# Altium project PCB_TeknoFest.PrjPcb
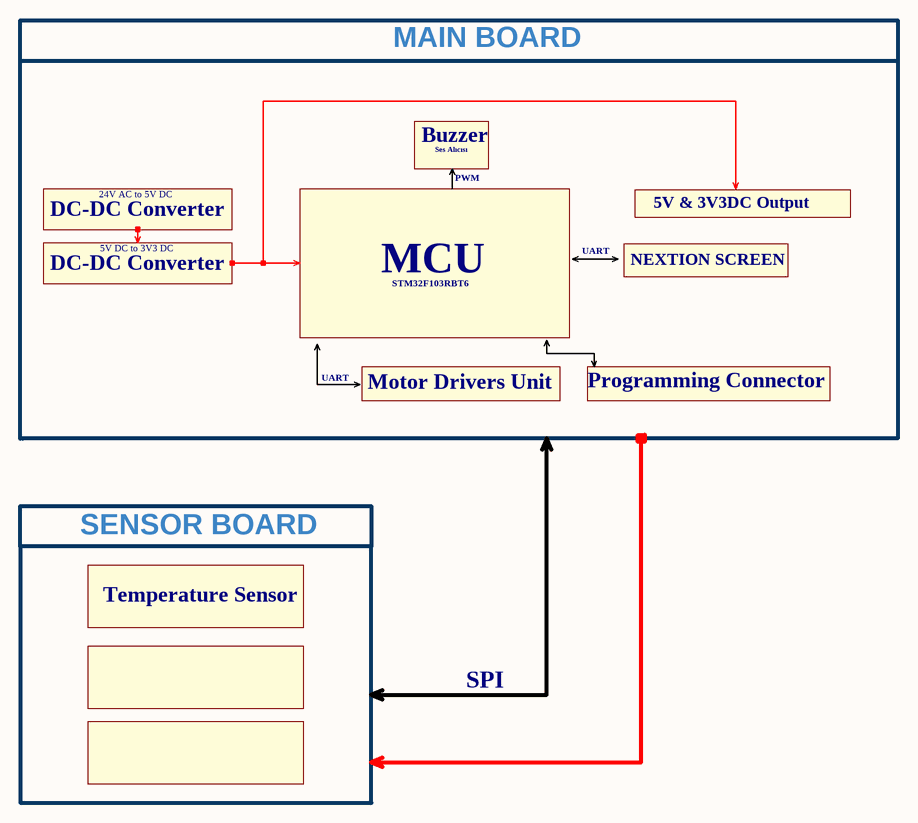
[diagram p0: BlockDiagram.SchDoc]
4 sheets, 71 parts. Net scope: flat (ports and power ports of the same name join across sheets).
Board file: TeknoFest.PcbDoc
Sheets:
  BlockDiagram.SchDoc
  MicroController.SchDoc
  PowerManagement.SchDoc
  MotorDriversUnit.SchDoc

## Sheet BlockDiagram.SchDoc
size A4; SheetNumber: 1; SheetTotal: 4

### Notes on the sheet
- MAIN BOARD
- 24V AC to 5V DC
- Buzzer
- Ses Alıcısı
- PWM
- DC-DC Converter
- 5V DC to 3V3 DC
- UART
- NEXTION SCREEN
- 5V & 3V3DC Output
- MCU
- STM32F103RBT6
- Motor Drivers Unit
- Programming Connector
- SENSOR BOARD
- Temperature Sensor
- SPI

## Sheet MicroController.SchDoc: Teknofest Project
size 381 x 241 mm; Date: 21/12/2023; SheetNumber: 2; SheetTotal: 4; Prepared by: Mustafa Oğuz Ateş
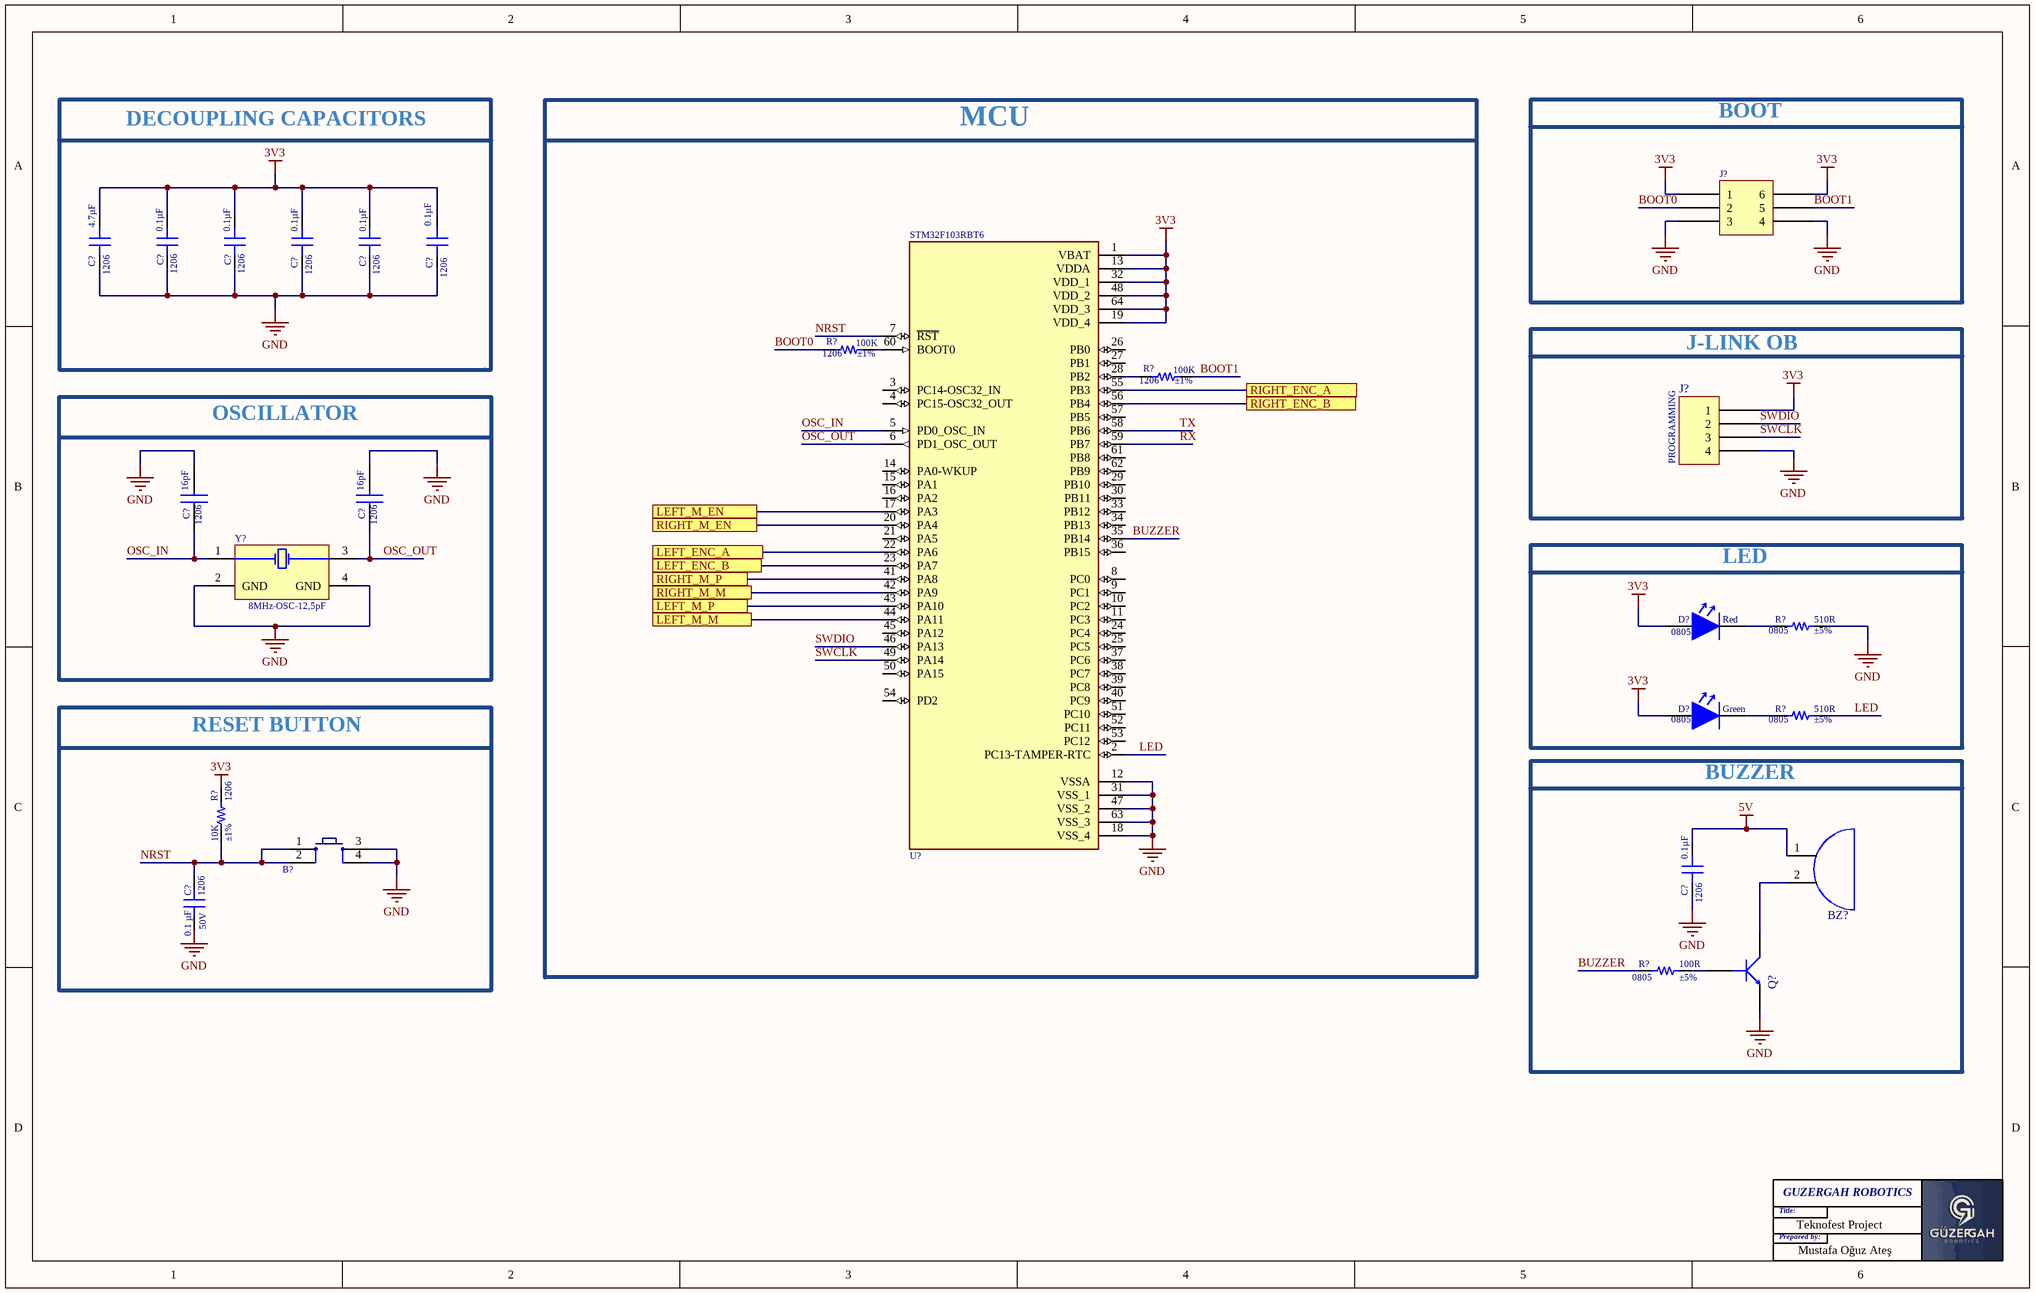
[diagram p1: MicroController.SchDoc]

### Parts
(Parts that share a designator on the sheet are numbered #1, #2 ... from top to bottom, then left to right.)
B?  Push Button  [PUSB BUTTON-SMD]  (value not drawn)
BZ?  CMI-9605IC-0580T  [CMI-9605IC]  (value not drawn)
C?#1  Package / Case: 1206  [CAP 1206_3216 - 1.0MM]  (hidden comment: 4.7µF)
C?#2  Package / Case: 1206  [CAP 1206_3216 - 1.0MM]  (hidden comment: 0.1µF)
C?#3  Package / Case: 1206  [CAP 1206_3216 - 1.0MM]  (hidden comment: 0.1µF)
C?#4  Package / Case: 1206  [CAP 1206_3216 - 1.0MM]  (hidden comment: 0.1µF)
C?#5  Package / Case: 1206  [CAP 1206_3216 - 1.0MM]  (hidden comment: 0.1µF)
C?#6  Package / Case: 1206  [CAP 1206_3216 - 1.0MM]  (hidden comment: 0.1µF)
C?#7  Parameter 1: 16pF  Device Package: 1206  [CAP_1206]
C?#8  Parameter 1: 16pF  Device Package: 1206  [CAP_1206]
C?#9  Package / Case: 1206  [CAP 1206_3216 - 1.0MM]  (hidden comment: 0.1µF)
C?#10  Package / Case: 1206  Voltage - Rated: 50V  [CAP 1206_3216 - 0.8MM]  (hidden comment: 0.1 µF)
D?#1  Color: Red  Case Code (Imperial): 0805  [LED_RED_0805]  (hidden comment: LH R974-LP-1)
D?#2  Case/Package: 0805  Color: Green  [LED_GREEN_0805]  (hidden comment: LTST-C171GKT)
J?#1  M20-7830342  [HARWIN M20-7830345]  (value not drawn)
J?#2  M20-7820442  [HARWIN M20-7820445]  (value not drawn)
Q?  MMBT3904-7-F  [SOT-23F]  (value not drawn)
R?#1  100K  Supplier Device Package: 1206  Tolerance: ±1%  [RES 1206_3216]
R?#2  100K  Supplier Device Package: 1206  Tolerance: ±1%  [RES 1206_3216]
R?#3  Supplier Device Package: 0805  Tolerance: ±5%  [RES 0805_2012]  (hidden comment: 510R)
R?#4  Supplier Device Package: 0805  Tolerance: ±5%  [RES 0805_2012]  (hidden comment: 510R)
R?#5  10K  Supplier Device Package: 1206  Tolerance: ±1%  [RES 1206_3216]
R?#6  Package / Case: 0805  Tolerance: ±5%  [RES 0805_2012]  (hidden comment: 100R)
U?#1  STM32F103RBT6  [LQFP-64]
Y?  8MHz-OSC-12,5pF  [8MHz-OSC]

### Blocks framed on the sheet
DECOUPLING CAPACITORS: C?#1-C?#6
BOOT: J?#1
MCU: R?#1 R?#2 U?#1
J-LINK OB: J?#2
LED: D?#1 D?#2 R?#3 R?#4
BUZZER: BZ? C?#9 Q? R?#6

### Ports
LEFT_ENC_A, LEFT_ENC_B, LEFT_M_EN, LEFT_M_M, LEFT_M_P, RIGHT_ENC_A, RIGHT_ENC_B, RIGHT_M_EN, RIGHT_M_M, RIGHT_M_P

### Nets
3V3: C?#1.2 C?#2.2 C?#3.2 C?#4.2 C?#5.2 C?#6.2 D?#1.2 D?#2.2 J?#1.1 J?#1.6 J?#2.1 R?#5.2 U?#1.1(VBAT) U?#1.13(VDDA) U?#1.19(VDD_4) U?#1.32(VDD_1) U?#1.48(VDD_2) U?#1.64(VDD_3)
5V: BZ?.1 C?#9.2
GND: B?.3 B?.4 C?#1.1 C?#2.1 C?#3.1 C?#4.1 C?#5.1 C?#6.1 C?#7.2 C?#8.2 C?#9.1 C?#10.2 J?#1.3 J?#1.4 J?#2.4 Q?.2(E) R?#3.2 U?#1.12(VSSA) U?#1.18(VSS_4) U?#1.31(VSS_1) U?#1.47(VSS_2) U?#1.63(VSS_3) Y?.2(GND) Y?.4(GND)
BOOT0: J?#1.2 R?#1.2
BOOT1: J?#1.5 R?#2.1
BUZZER: R?#6.1 U?#1.35(PB14)
LED: R?#4.2 U?#1.2(PC13-TAMPER-RTC)
NRST: B?.1 B?.2 C?#10.1 R?#5.1 U?#1.7(~{RST})
OSC_IN: C?#7.1 U?#1.5(PD0_OSC_IN) Y?.1(Tristate)
OSC_OUT: C?#8.1 U?#1.6(PD1_OSC_OUT) Y?.3(OUT)
RX: U?#1.59(PB7)
SWCLK: J?#2.3 U?#1.49(PA14)
SWDIO: J?#2.2 U?#1.46(PA13)
TX: U?#1.58(PB6)
NetBZ?_2: BZ?.2 Q?.3(C)
NetD?#1_1: D?#1.1 R?#3.1
NetD?#2_1: D?#2.1 R?#4.1
NetJ?#10_1: U?#1.17(PA3) ; port LEFT_M_EN
NetJ?#10_2: U?#1.43(PA10) ; port LEFT_M_P
NetJ?#10_3: U?#1.44(PA11) ; port LEFT_M_M
NetJ?#11_1: U?#1.20(PA4) ; port RIGHT_M_EN
NetJ?#11_2: U?#1.41(PA8) ; port RIGHT_M_P
NetJ?#11_3: U?#1.42(PA9) ; port RIGHT_M_M
NetJ?#12_2: U?#1.55(PB3) ; port RIGHT_ENC_A
NetJ?#12_3: U?#1.56(PB4) ; port RIGHT_ENC_B
NetJ?#13_2: U?#1.22(PA6) ; port LEFT_ENC_A
NetJ?#13_3: U?#1.23(PA7) ; port LEFT_ENC_B
NetQ?_1: Q?.1(B) R?#6.2
NetR?#1_1: R?#1.1 U?#1.60(BOOT0)
NetR?#2_2: R?#2.2 U?#1.28(PB2)

Not connected (* = marked no-connect by the designer): U?#1 3(PC14-OSC32_IN) 4(PC15-OSC32_OUT) 8(PC0) 9(PC1) 10(PC2) 11(PC3) 14(PA0-WKUP) 15(PA1) 16(PA2) 21(PA5) 24(PC4) 25(PC5) 26(PB0) 27(PB1) 29(PB10) 30(PB11) 33(PB12) 34(PB13) 36(PB15) 37(PC6) 38(PC7) 39(PC8) 40(PC9) 45(PA12) 50(PA15) 51(PC10) 52(PC11) 53(PC12) 54(PD2) 57(PB5) 61(PB8) 62(PB9)

### Notes on the sheet
- OSCILLATOR
- (near J?#2) PROGRAMMING
- RESET BUTTON
- Title:
- Prepared by:
- GUZERGAH ROBOTICS

### Library data of the parts
B? = Push Button: Smd Push Button; Satın Alma Linki: https://urun.n11.com/diger/mini-pushbutton-switch-smd-P227461537?gclid=Cj0KCQjwkoDmBRCcARIsAG3xzl8Y_-jeD7HocNM6lvuZ_rVp83568XPGtNzlPwXWLph8oCRqo0yh87UaApZYEALw_wcB&gclsrc=aw.ds
BZ? = CMI-9605IC-0580T: Audio Buzzer Magnetic 3VDC 7VDC 30mA 5VDC 85dB 2600Hz to 2800Hz Through Hole Pin Box; Manufacturer: CUI Devices; Designed by: Mustafa; Supplier: Digi-Key; Supplier Part Number: 2223-CMI-9605IC-0580T-ND; Manufacturer Part Number: CMI-9605IC-0580T; RoHS: No; Category: Audio Products; Stock: 5910; Pricing: 1=1,22, 10=1,014, 25=0,938, 50=0,883, 100=0,8298, 250=0,76976, 500=0,71396, 1000=0,66741, 5000=0,65403 (USD); Case/Package: CMI-9605IC
C?#1 = 1206ZC475MAT2A: CAP CER 4.7UF 10V X7R 1206; manufacturer: AVX Corporation; Tolerance: ±20%; Part Number: 1206ZC475MAT2A; Value: 4.7µF; Applications: General Purpose; Capacitance: 4.7µF; componentlink1description: Datasheet; componentlink1url: http://datasheets.avx.com/X7RDielectric.pdf; componentlink2description: DigiKey Link; componentlink2url: http://digikey.com/product-detail/en/avx-corporation/1206ZC475MAT2A/478-12250-1-ND/9565657; Device Package: 1206 (3216 Metric); lastupdated: 2.09.2020 01:05:04; Lifecycle Status: Active; Minimum Order: 1; Mounting Type: Surface Mount, MLCC; Operating Temperature: -55°C ~ 125°C; packaging: TapeAndReel; partid: 19450; Part Status: Active; price: 0.08; series: -; Size / Dimension: 0.126" L x 0.063" W (3.20mm x 1.60mm); Supplier 1: DigiKey; Supplier Part Number 1: 478-12250-1-ND; Temperature Coefficient: X7R; Thickness (Max): 0.037" (0.94mm); Voltage - Rated: 10V
C?#2-C?#6 C?#9 = 1206ZC475MAT2A: CAP CER 4.7UF 10V X7R 1206; manufacturer: AVX Corporation; Capacitance: 40.1µF; Tolerance: ±20%; Part Number: 1206ZC475MAT2A; Value: 0.1µF; Applications: General Purpose; componentlink1description: Datasheet; componentlink1url: http://datasheets.avx.com/X7RDielectric.pdf; componentlink2description: DigiKey Link; componentlink2url: http://digikey.com/product-detail/en/avx-corporation/1206ZC475MAT2A/478-12250-1-ND/9565657; Device Package: 1206 (3216 Metric); lastupdated: 2.09.2020 01:05:04; Lifecycle Status: Active; Minimum Order: 1; Mounting Type: Surface Mount, MLCC; Operating Temperature: -55°C ~ 125°C; packaging: TapeAndReel; partid: 19450; Part Status: Active; price: 0.08; series: -; Size / Dimension: 0.126" L x 0.063" W (3.20mm x 1.60mm); Supplier 1: DigiKey; Supplier Part Number 1: 478-12250-1-ND; Temperature Coefficient: X7R; Thickness (Max): 0.037" (0.94mm); Voltage - Rated: 10V
C?#7 C?#8 = CAP CER 16pF 1206: Value: 16pF; Capacitance: 16pF
C?#10 = CC1206MRY5V9BB104: CAP CER 0.1UF 50V Y5V 1206; manufacturer: Yageo; Temperature Coefficient: Y5V (F); Tolerance: ±20%; Part Number: CC1206MRY5V9BB104; Value: 0.1 µF; Applications: General Purpose; Capacitance: 0.1 µF; componentlink1description: Datasheet; componentlink1url: http://www.yageo.com/documents/recent/UPY-GPHC_Y5V_6.3V-to-50V_8.pdf; componentlink2description: DigiKey Link; componentlink2url: https://www.digikey.com/en/products/detail/yageo/CC1206MRY5V9BB104/5884674; Device Package: 1206 (3216 Metric); lastupdated: 24.12.2023 20:16:49; Lifecycle Status: Active; Minimum Order: 1; Mounting Type: Surface Mount, MLCC; Operating Temperature: -30°C ~ 85°C; packaging: TapeAndReel; partid: 18711; Part Status: Active; price: 0.04; series: CC; Size / Dimension: 0.126" L x 0.063" W (3.20mm x 1.60mm); Supplier 1: DigiKey; Supplier Part Number 1: 311-4504-1-ND; Thickness (Max): 0.028" (0.70mm)
D?#1 = LED RED 0805: LED Uni-Color Hyper Red 660nm 2-Pin Chip 0805(2012Metric) T/R; Manufacturer: Osram Opto; Lens Color: White; Forward Voltage: 1.8V; Lens Style: Diffused,Flat,Colorless; Luminous Intensity: 71mcd; Viewing Angle: 160°; Forward Current: 30mA; Dominant Wavelength: 645nm; Number of Elements: 1; Test Current: 20mA; Reverse Voltage: 5V; Lens Transparency: Diffused; Luminous Flux: 0.17lm; Lens Size: 1.25mm; Designed by: Mustafa; Supplier 1: Digi-Key; Manufacturer Part Number: LH R974-LP-1; RoHS: Yes; Category: LEDs; Stock 1: 35632; Pricing 1: 1=0,26000, 10=0,13900, 100=0,06480, 500=0,05978, 1000=0,04683, 2000=0,04584 (USD); Mount: Surface Mount; Case/Package: 0805; Number of Pins: 2; Case Code (Metric): 2012; Min Operating Temperature: -30°C; Max Operating Temperature: 85°C; Packaging: Tape and Reel; Illumination Color: Red; Package Quantity: 1; Series: CHipLED; Length: 2.1mm; Width: 1.25mm; Depth: 1.35mm; Radiation Hardening: No; RoHS Compliant: Yes; ComponentLink1URL: http://www.jameco.com/Jameco/Products/ProdDS/2085634.pdf?src-supplier=Jameco; ComponentLink1Description: http://www.jameco.com/Jameco/Products/ProdDS/2085634.pdf?src-supplier=Jameco; ComponentLink2URL: http://components.arrow.com/part/dataview/0323_01825492?src-supplier=Arrow+Europe; ComponentLink2Description: http://components.arrow.com/part/dataview/0323_01825492?src-supplier=Arrow+Europe; ComponentLink3URL: https://dammedia.osram.info/media/resource/hires/osram-dam-2493888/LH%20R974.pdf?src-supplier=Digi-Key; ComponentLink3Description: https://dammedia.osram.info/media/resource/hires/osram-dam-2493888/LH%20R974.pdf?src-supplier=Digi-Key; ComponentLink4URL: http://www.mouser.com/ds/2/311/LH%20R974%20-%20CHIPLED%200805-318659.pdf?src-supplier=Mouser; ComponentLink4Description: http://www.mouser.com/ds/2/311/LH%20R974%20-%20CHIPLED%200805-318659.pdf?src-supplier=Mouser; ComponentLink5URL: https://www.verical.com/server-webapp/html/getDatasheet?partID=258950&src-supplier=Verical; ComponentLink5Description: https://www.verical.com/server-webapp/html/getDatasheet?partID=258950&src-supplier=Verical; ComponentLink6URL: http://components.arrow.com/part/dataview/41971690S1077610N9133?src-supplier=Arrow+Electronics; ComponentLink6Description: http://components.arrow.com/part/dataview/41971690S1077610N9133?src-supplier=Arrow+Electronics; ComponentLink7URL: http://components.arrow.com/part/dataview/41971690S6190115N2128?src-supplier=Arrow+Electronics; ComponentLink7Description: http://components.arrow.com/part/dataview/41971690S6190115N2128?src-supplier=Arrow+Electronics; Supplier Part Number 1: 475-1415-1-ND
D?#2 = LED GREEN 0805: Green 0805 130 º Min 5 mcd Typical 12 mcd Water Clear Lens SMT LED; Manufacturer: Vishay Lite-On; Designed by: Mustafa; Lens Color: Colorless; Viewing Angle: 130°; Lens Style: Diffused,Colorless,Rectangular,Clear; Luminous Intensity: 12mcd; Forward Current: 30mA; Forward Voltage: 2.1V; Power Rating: 100mW; Dominant Wavelength: 569nm; Test Current: 10mA; Number of Elements: 1; Wavelength: 585nm; Reverse Voltage: 5V; Supplier 1: Digi-Key; Manufacturer Part Number: LTST-C171GKT; RoHS: Yes; Category: LEDs; Stock 1: 159023; Pricing 1: 1=0,26000, 10=0,14100, 100=0,06560, 500=0,06060, 1000=0,04747 (USD); Mount: Surface Mount; Number of Pins: 2; Case Code (Metric): 2012; Case Code (Imperial): 0805; Min Operating Temperature: -55°C; Max Operating Temperature: 85°C; Package Quantity: 1; Packaging: Tape and Reel; Illumination Color: Green; Lens Transparency: Clear; Power Dissipation: 100mW; Number of LEDs: 1; Series: CHIPLED 0805; Length: 2mm; Width: 1.25mm; Height: 0.8mm; Depth: 1.25mm; Radiation Hardening: No; Lead Free: Lead Free; RoHS Compliant: Yes; ComponentLink1URL: https://datasheet.ciiva.com/2110/ltst-c171gkt-2110000.pdf?src-supplier=Digi-Key; ComponentLink1Description: https://datasheet.ciiva.com/2110/ltst-c171gkt-2110000.pdf?src-supplier=Digi-Key; ComponentLink2URL: https://datasheet.ciiva.com/11773/0900766b80dc0296-11773991.pdf?src-supplier=RSComponents; ComponentLink2Description: https://datasheet.ciiva.com/11773/0900766b80dc0296-11773991.pdf?src-supplier=RSComponents; ComponentLink3URL: https://datasheet.ciiva.com/12400/lite-on-ltst-c171gkt-190133-12400647.pdf?src-supplier=Mouser; ComponentLink3Description: https://datasheet.ciiva.com/12400/lite-on-ltst-c171gkt-190133-12400647.pdf?src-supplier=Mouser; ComponentLink4URL: https://datasheet.ciiva.com/2110/ltst-c171gkt-2110001.pdf?src-supplier=Digi-Key; ComponentLink4Description: https://datasheet.ciiva.com/2110/ltst-c171gkt-2110001.pdf?src-supplier=Digi-Key; ComponentLink5URL: https://datasheet.ciiva.com/2110/ltst-c171gkt-2110002.pdf?src-supplier=Digi-Key; ComponentLink5Description: https://datasheet.ciiva.com/2110/ltst-c171gkt-2110002.pdf?src-supplier=Digi-Key; ComponentLink6URL: https://datasheet.ciiva.com/16396/ltst-c171gkt-16396549.pdf?src-supplier=Future+Electronics; ComponentLink6Description: https://datasheet.ciiva.com/16396/ltst-c171gkt-16396549.pdf?src-supplier=Future+Electronics; Supplier Part Number 1: 160-1423-1-ND
J?#1 = M20-7830342: CONN RCPT 6POS 0.1 GOLD PCB; Part Number: M20-7830342
J?#2 = M20-7820442: CONN RCPT 4POS 0.1 GOLD PCB; Part Number: M20-7820442
Q? = MMBT3904-7-F: Transistor General Purpose BJT NPN 40 Volt 0.2A Automotive 3-Pin SOT-23; Manufacturer: Diodes Zetex; Designed by: BERK; Max Power Dissipation: 300mW; Collector Emitter Voltage (VCEO): 40V; Max Collector Current: 200mA; Collector Base Voltage (VCBO): 60V; Frequency: 300MHz; hFE Min: 100; Number of Elements: 1; Emitter Base Voltage (VEBO): 6V; Collector Emitter Saturation Voltage: 300mV; Power Dissipation: 350mW; Element Configuration: Single; Supplier 1: Digi-Key; Manufacturer Part Number: MMBT3904-7-F; RoHS: Yes; Category: BJTs; Stock 1: 2393281; Pricing 1: 1=0,12000, 10=0,08600, 25=0,08280, 100=0,04660, 500=0,03664, 1000=0,02544 (USD); Mount: Surface Mount; Case/Package: SOT-23; Number of Pins: 3; Weight: 0.000282oz; Contact Plating: Tin,Matte; Min Operating Temperature: -55°C; Max Operating Temperature: 150°C; Polarity: NPN; Packaging: Tape and Reel; Package Quantity: 3000; Transition Frequency: 300MHz; Collector Emitter Breakdown Voltage: 40V; Max Breakdown Voltage: 40V; Continuous Collector Current: 200mA; Max Frequency: 300MHz; Gain Bandwidth Product: 300MHz; Series: -; Collector-emitter Voltage-Max: 300mV; Voltage Rating (DC): 40V; Length: 3.05mm; Width: 1.4mm; Height: 1mm; Radiation Hardening: No; REACH SVHC: No SVHC; Lead Free: Lead Free; RoHS Compliant: Yes; ComponentLink1URL: https://datasheet.ciiva.com/11201/ds30036-11201778.pdf?src-supplier=Avnet; ComponentLink1Description: https://datasheet.ciiva.com/11201/ds30036-11201778.pdf?src-supplier=Avnet; ComponentLink2URL: https://datasheet.ciiva.com/15138/getdatasheetpartid-53265-15138780.pdf?src-supplier=Verical; ComponentLink2Description: https://datasheet.ciiva.com/15138/getdatasheetpartid-53265-15138780.pdf?src-supplier=Verical; ComponentLink3URL: https://datasheet.ciiva.com/6361/ds30036-6361254.pdf?src-supplier=Digi-Key; ComponentLink3Description: https://datasheet.ciiva.com/6361/ds30036-6361254.pdf?src-supplier=Digi-Key; ComponentLink4URL: https://datasheet.ciiva.com/22711/1915516-22711750.pdf?src-supplier=Element14; ComponentLink4Description: https://datasheet.ciiva.com/22711/1915516-22711750.pdf?src-supplier=Element14; ComponentLink5URL: https://datasheet.ciiva.com/11198/ds30036-11198999.pdf?src-supplier=Avnet; ComponentLink5Description: https://datasheet.ciiva.com/11198/ds30036-11198999.pdf?src-supplier=Avnet; ComponentLink6URL: https://datasheet.ciiva.com/6361/ds30036-6361256.pdf?src-supplier=Digi-Key; ComponentLink6Description: https://datasheet.ciiva.com/6361/ds30036-6361256.pdf?src-supplier=Digi-Key; Supplier Part Number 1: MMBT3904-FDIDKR-ND
R?#1 R?#2 R?#5 = CR1206AFX-1002EAS: RESA-AS 1206 10K 1% 250MW TC100; Manufacturer: Bourns Inc.; Power (Watts): 0.25W, 1/4W; Temperature Coefficient: ±100ppm/°C; Part Number: CR1206AFX-1002EAS; ComponentLink1Description: Datasheet; ComponentLink1URL: //media.digikey.com/pdf/Data%20Sheets/Bourns%20PDFs/CRyyyyA-AS_Model_DS.pdf; ComponentLink2Description: DigiKey Link; ComponentLink2URL: https://www.digikey.com/en/products/detail/bourns-inc/CR1206AFX-1002EAS/10240135; Composition: Thick Film; Device Package: 1206 (3216 Metric); Features: Anti-Sulfur, Automotive AEC-Q200, Moisture Resistant; Height - Seated (Max): 0.026" (0.65mm); LastUpdated: 25.12.2023 20:50:47; Lifecycle Status: Active; Minimum Order: 1; Number of Terminations: 2; Operating Temperature: -55°C ~ 155°C; Package / Case: 1206 (3216 Metric); Packaging: TapeAndReel; PartId: 26960; Part Status: Active; Price: 0.01; Ratings: AEC-Q200; Series: CR1206A-AS; Size / Dimension: 0.122" L x 0.061" W (3.10mm x 1.55mm); Supplier 1: DigiKey; Supplier Part Number 1: 118-CR1206AFX-1002EASCT-ND
  R?#1 R?#2: Resistance: 100k; Value: 100K
  R?#5: Resistance: 10K; Value: 10K
R?#3 R?#4 R?#6 = ERJ-6GEYJ331V: RES SMD 330 OHM 5% 1/8W 0805; Manufacturer: Panasonic Electronic Components; Power (Watts): 0.125W, 1/8W; Temperature Coefficient: ±200ppm/°C; Part Number: ERJ-6GEYJ331V; ComponentLink1Description: Datasheet; ComponentLink1URL: http://industrial.panasonic.com/www-cgi/jvcr13pz.cgi?E+PZ+3+AOA0001+ERJ6GEYJ331V+7+WW; ComponentLink2Description: DigiKey Link; ComponentLink2URL: https://www.digikey.com/en/products/detail/panasonic-electronic-components/ERJ-6GEYJ331V/89726; Composition: Thick Film; Device Package: 0805 (2012 Metric); Features: Automotive AEC-Q200; Height - Seated (Max): 0.028" (0.70mm); LastUpdated: 6.02.2024 21:02:13; Lifecycle Status: Active; Minimum Order: 1; Number of Terminations: 2; Operating Temperature: -55°C ~ 155°C; Packaging: TapeAndReel; PartId: 30017; Part Status: Active; Price: 0.01; Ratings: AEC-Q200; Series: ERJ-6G; Size / Dimension: 0.079" L x 0.049" W (2.00mm x 1.25mm); Supplier 1: DigiKey; Supplier Part Number 1: P330ACT-ND
  R?#3 R?#4: Value: 510R; Package / Case: 0805 (2012 Metric); Resistance: 510R
  R?#6: Value: 100R; Resistance: 100R; Supplier Device Package: 0805
U?#1 = STM32F103RBT6: STM32F103RTB6 LQFP-64; MF: STMicroelectronics; Designed by: Mustafa Oğuz Ateş; Package: LQFP-64 STMicroelectronics; Price: None; Check_prices: https://www.snapeda.com/parts/STM32F103RBT6/STMicroelectronics/view-part/?ref=eda; Value: *; SnapEDA_Link: https://www.snapeda.com/parts/STM32F103RBT6/STMicroelectronics/view-part/?ref=snap; MP: STM32F103RBT6; Availability: In Stock; Purchase-URL: https://pricing.snapeda.com/search?q=STM32F103RBT6&ref=eda
Y? = OSI-8MHz: CRYSTAL 8MHZ 12.5pF SMD TR RALTRON; Frequency Tolerance: ±20PPM; Frequency Stability: ±15PPM; Equivalent Series Resistance (ESR): 100 Ohms; Frequency: 8MHz; Capacitance: 12.5pF; Operating Temperature: -40°C~+85°C; Dimensions (mm): 3.20x2.50x0.70; Packaging: TAPE&REEL; Package / Case: 4-SMD; Series: RH100; Manufacturer: RALTRON; Mounting Type: SMT

## Sheet PowerManagement.SchDoc: Teknofest Project
size 381 x 241 mm; SheetNumber: 3; SheetTotal: 4; Prepared by: Mustafa Oğuz Ateş
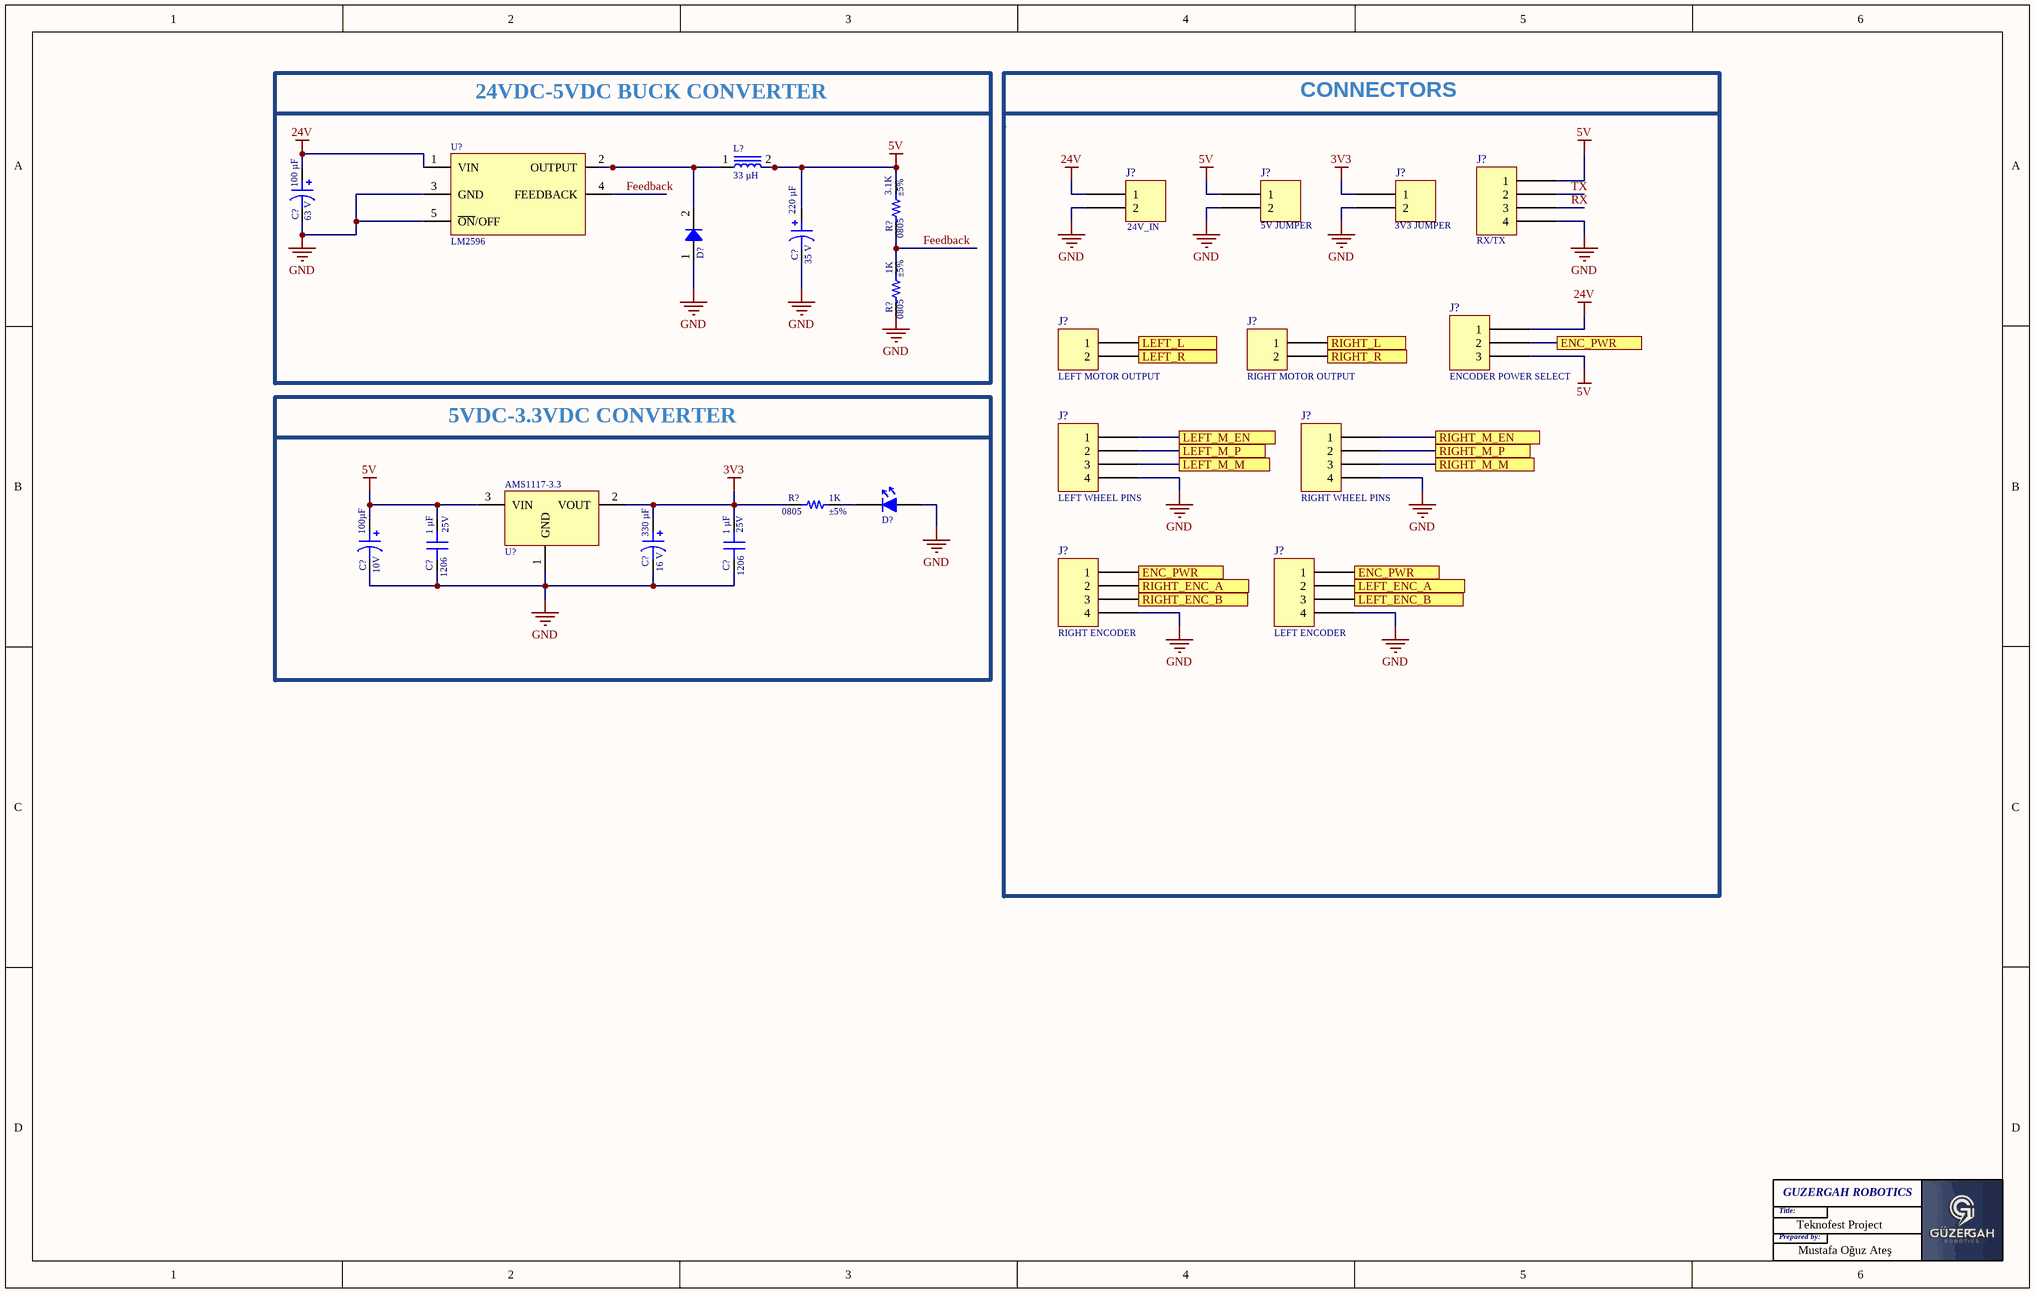
[diagram p2: PowerManagement.SchDoc]

### Parts
(Parts that share a designator on the sheet are numbered #1, #2 ... from top to bottom, then left to right.)
C?#11  100 µF  Voltage - Rated: 63 V  [CAP AL TH D8 L3.5 H12.5]
C?#12  220 µF  Voltage - Rated: 35 V  [CAP AL TH D8 L3.5 H12.5]
C?#13  100µF  Voltage - Rated: 10V  [CAP TH ALUM ELEC D6.30mm S2.50mm H12.50mm]
C?#14  Device Package: 1206  Voltage - Rated: 25V  [CAP 1206_3216 - 0.8MM]  (hidden comment: 1 µF)
C?#15  330 µF  Voltage - Rated: 16 V  [CAP AL TH D8 L3.5 H12.5]
C?#16  Package / Case: 1206  Voltage - Rated: 25V  [CAP 1206_3216 - 0.8MM]  (hidden comment: 1 µF)
D?#3  ACDBA560-HF  [DO214AC SMA]  (value not drawn)
D?#4  LH R974-LP-1  [LED_RED_0805]  (value not drawn)
J?#3  24V_IN  [HARWIN M20-7820245]
J?#4  5V JUMPER  [HARWIN M20-7820245]
J?#5  3V3 JUMPER  [HARWIN M20-7820245]
J?#6  RX/TX  [SULLINS NPPN041BFCN]
J?#7  LEFT MOTOR OUTPUT  [HARWIN M20-7820245]
J?#8  RIGHT MOTOR OUTPUT  [HARWIN M20-7820245]
J?#9  ENCODER POWER SELECT  [SULLINS NPPN031BFCN]
J?#10  LEFT WHEEL PINS  [SULLINS NPPN041BFCN]
J?#11  RIGHT WHEEL PINS  [SULLINS NPPN041BFCN]
J?#12  RIGHT ENCODER  [SULLINS NPPN041BFCN]
J?#13  LEFT ENCODER  [SULLINS NPPN041BFCN]
L?  33 µH  [BOURNS SRR1280]
R?#7  Package / Case: 0805  Tolerance: ±5%  [RES 0805_2012]  (hidden comment: 3.1K)
R?#8  Package / Case: 0805  Tolerance: ±5%  [RES 0805_2012]  (hidden comment: 1K)
R?#9  Package / Case: 0805  Tolerance: ±5%  [RES 0805_2012]  (hidden comment: 1K)
U?#2  LM2596  [D2PAK]
U?#3  AMS1117-3.3  [SOT-223]

### Blocks framed on the sheet
24VDC-5VDC BUCK CONVERTER: C?#11 C?#12 D?#3 L? R?#7 R?#8 U?#2
CONNECTORS: J?#3-J?#13
5VDC-3.3VDC CONVERTER: C?#13-C?#16 D?#4 R?#9 U?#3

### Ports
ENC_PWR, LEFT_ENC_A, LEFT_ENC_B, LEFT_L, LEFT_M_EN, LEFT_M_M, LEFT_M_P, LEFT_R, RIGHT_ENC_A, RIGHT_ENC_B, RIGHT_L, RIGHT_M_EN, RIGHT_M_M, RIGHT_M_P, RIGHT_R

### Nets
3V3: C?#15.1 C?#16.2 J?#5.1 R?#9.1 U?#3.2(VOUT)
5V: C?#12.1 C?#13.1 C?#14.2 J?#4.1 J?#6.1 J?#9.3 L?.2 R?#7.2 U?#3.3(VIN)
24V: C?#11.1 J?#3.1 J?#9.1 U?#2.1(VIN)
GND: C?#11.2 C?#12.2 C?#13.2 C?#14.1 C?#15.2 C?#16.1 D?#3.1 D?#4.2 J?#3.2 J?#4.2 J?#5.2 J?#6.4 J?#10.4 J?#11.4 J?#12.4 J?#13.4 R?#8.1 U?#2.3(GND) U?#2.5(~{ON}/OFF) U?#3.1(GND)
Feedback: R?#7.1 R?#8.2 U?#2.4(FEEDBACK)
RX: J?#6.3
TX: J?#6.2
NetD?#3_2: D?#3.2 L?.1 U?#2.2(OUTPUT)
NetD?#4_1: D?#4.1 R?#9.2
NetJ?#7_1: J?#7.1 ; port LEFT_L
NetJ?#7_2: J?#7.2 ; port LEFT_R
NetJ?#8_1: J?#8.1 ; port RIGHT_L
NetJ?#8_2: J?#8.2 ; port RIGHT_R
NetJ?#9_2: J?#9.2 J?#12.1 J?#13.1 ; port ENC_PWR
NetJ?#10_1: J?#10.1 ; port LEFT_M_EN
NetJ?#10_2: J?#10.2 ; port LEFT_M_P
NetJ?#10_3: J?#10.3 ; port LEFT_M_M
NetJ?#11_1: J?#11.1 ; port RIGHT_M_EN
NetJ?#11_2: J?#11.2 ; port RIGHT_M_P
NetJ?#11_3: J?#11.3 ; port RIGHT_M_M
NetJ?#12_2: J?#12.2 ; port RIGHT_ENC_A
NetJ?#12_3: J?#12.3 ; port RIGHT_ENC_B
NetJ?#13_2: J?#13.2 ; port LEFT_ENC_A
NetJ?#13_3: J?#13.3 ; port LEFT_ENC_B

### Notes on the sheet
- Title:
- Prepared by:
- GUZERGAH ROBOTICS
- (in symbol AMS1117-3.3) /

### Library data of the parts
C?#11 = ECA-1JM101: CAP ALUM 100UF 20% 63V RADIAL; manufacturer: Panasonic Electronic Components; Lifetime @ Temp.: 2000 Hrs @ 85°C; Polarization: Polar; Ripple Current @ High Frequency: 459 mA @ 10 kHz; Ripple Current @ Low Frequency: 270 mA @ 120 Hz; Part Number: ECA-1JM101; Applications: General Purpose; Capacitance: 100 µF; componentlink1description: Datasheet; componentlink1url: //media.digikey.com/pdf/Data%20Sheets/Panasonic%20Electronic%20Components/ECA-xxM%20Series,TypeA.pdf; componentlink2description: DigiKey Link; componentlink2url: https://www.digikey.com/en/products/detail/panasonic-electronic-components/ECA-1JM101/245052; Device Package: Radial, Can; Height - Seated (Max): 0.492" (12.50mm); lastupdated: 14.12.2023 21:37:37; Lead Spacing: 0.138" (3.50mm); Lifecycle Status: Active; Minimum Order: 1; Mounting Type: Through Hole; Operating Temperature: -40°C ~ 85°C; Package / Case: Radial, Can; packaging: Bulk; partid: 7225; Part Status: Active; price: 0.11; series: M-A; Size / Dimension: 0.315" Dia (8.00mm); Supplier 1: DigiKey; Supplier Part Number 1: P5193-ND; Tolerance: ±20%; value: 100 µF
C?#12 = ECA-1VM221: CAP ALUM 220UF 20% 35V RADIAL; manufacturer: Panasonic Electronic Components; Lifetime @ Temp.: 2000 Hrs @ 85°C; Polarization: Polar; Ripple Current @ High Frequency: 595 mA @ 10 kHz; Ripple Current @ Low Frequency: 350 mA @ 120 Hz; Part Number: ECA-1VM221; Applications: General Purpose; Capacitance: 220 µF; componentlink1description: Datasheet; componentlink1url: //media.digikey.com/pdf/Data%20Sheets/Panasonic%20Electronic%20Components/ECA-xxM%20Series,TypeA.pdf; componentlink2description: DigiKey Link; componentlink2url: https://www.digikey.com/en/products/detail/panasonic-electronic-components/ECA-1VM221/245025; Device Package: Radial, Can; Height - Seated (Max): 0.492" (12.50mm); lastupdated: 14.12.2023 21:37:36; Lead Spacing: 0.138" (3.50mm); Lifecycle Status: Active; Minimum Order: 1; Mounting Type: Through Hole; Operating Temperature: -40°C ~ 85°C; Package / Case: Radial, Can; packaging: Bulk; partid: 7280; Part Status: Active; price: 0.09; series: M-A; Size / Dimension: 0.315" Dia (8.00mm); Supplier 1: DigiKey; Supplier Part Number 1: P5166-ND; Tolerance: ±20%; value: 220 µF
C?#13 = UPJ1A101MED1TD: CAP ALUM 100UF 20% 10V RADIAL; manufacturer: Nichicon; Impedance: 840 mOhms; Lifetime @ Temp.: 2000 Hrs @ 105°C; Polarization: Polar; Ripple Current @ High Frequency: 210mA @ 10kHz; Ripple Current @ Low Frequency: 135mA @ 120Hz; Part Number: UPJ1A101MED1TD; Applications: General Purpose; Capacitance: 100µF; componentlink1description: Datasheet; componentlink1url: http://nichicon-us.com/english/products/pdfs/e-upj.pdf; componentlink2description: DigiKey Link; componentlink2url: http://digikey.com/product-detail/en/nichicon/UPJ1A101MED1TD/493-11407-1-ND/4319405; Device Package: Radial, Can; Height - Seated (Max): 0.492" (12.50mm); lastupdated: 4.09.2020 01:05:49; Lead Spacing: 0.098" (2.50mm); Lifecycle Status: Active; Minimum Order: 1; Mounting Type: Through Hole; Operating Temperature: -55°C ~ 105°C; Package / Case: Radial, Can; packaging: TapeAndBox; partid: 20688; Part Status: Active; price: 0.06; series: UPJ; Size / Dimension: 0.248" Dia (6.30mm); Supplier 1: DigiKey; Supplier Part Number 1: 493-11407-1-ND; Tolerance: ±20%; value: 100µF
C?#14 C?#16 = CC1206KKX7R8BB105: CAP CER 1UF 25V X7R 1206; manufacturer: Yageo; Tolerance: ±10%; Part Number: CC1206KKX7R8BB105; Value: 1 µF; Applications: General Purpose; Capacitance: 1 µF; componentlink1description: Datasheet; componentlink1url: https://www.yageo.com/upload/media/product/productsearch/datasheet/mlcc/UPY-GPHC_X7R_6.3V-to-50V_18.pdf; componentlink2description: DigiKey Link; componentlink2url: https://www.digikey.com/en/products/detail/yageo/CC1206KKX7R8BB105/2103094; lastupdated: 5.02.2024 20:18:27; Lifecycle Status: Active; Minimum Order: 1; Mounting Type: Surface Mount, MLCC; Operating Temperature: -55°C ~ 125°C; packaging: TapeAndReel; partid: 18923; Part Status: Active; price: 0.03; series: CC; Size / Dimension: 0.126" L x 0.063" W (3.20mm x 1.60mm); Supplier 1: DigiKey; Supplier Part Number 1: 311-1356-1-ND; Temperature Coefficient: X7R; Thickness (Max): 0.045" (1.15mm)
  C?#14: Package / Case: 1206 (3216 Metric)
  C?#16: Device Package: 1206 (3216 Metric)
C?#15 = UKW1C331MPD1TD: CAP ALUM 330UF 20% 16V RADIAL; manufacturer: Nichicon; Lifetime @ Temp.: 2000 Hrs @ 85°C; Polarization: Polar; Ripple Current @ Low Frequency: 360 mA @ 120 Hz; Part Number: UKW1C331MPD1TD; Applications: Audio; Capacitance: 330 µF; componentlink1description: Datasheet; componentlink1url: http://nichicon-us.com/english/products/pdfs/e-ukw.pdf; componentlink2description: DigiKey Link; componentlink2url: https://www.digikey.com/en/products/detail/nichicon/UKW1C331MPD1TD/4317335; Device Package: Radial, Can; Height - Seated (Max): 0.492" (12.50mm); lastupdated: 3.06.2024 20:06:12; Lead Spacing: 0.138" (3.50mm); Lifecycle Status: Active; Minimum Order: 1; Mounting Type: Through Hole; Operating Temperature: -40°C ~ 85°C; Package / Case: Radial, Can; packaging: TapeAndBox; partid: 7215; Part Status: Active; price: 0.23; series: UKW; Size / Dimension: 0.315" Dia (8.00mm); Supplier 1: DigiKey; Supplier Part Number 1: 493-10757-1-ND; Tolerance: ±20%; value: 330 µF
D?#3 = ACDBA560-HF: DIODE SCHOTTKY 60V 5A DO214AC; Manufacturer: Comchip Technology; Capacitance @ Vr, F: 250pF @ 4V, 1MHz; Current - Reverse Leakage @ Vr: 500 µA @ 60 V; Speed: Fast Recovery =< 500ns, > 200mA (Io); Voltage - Forward (Vf) (Max) @ If: 700 mV @ 5 A; Part Number: ACDBA560-HF; ComponentLink1Description: Datasheet; ComponentLink1URL: http://www.comchiptech.com/admin/files/product/ACDBA560-HF%20RevA201382.pdf; ComponentLink2Description: DigiKey Link; ComponentLink2URL: https://www.digikey.com/en/products/detail/comchip-technology/ACDBA560-HF/7100903; Current - Average Rectified (Io): 5A; Diode Type: Schottky; LastUpdated: 14.12.2023 21:25:59; Lifecycle Status: Active; Minimum Order: 1; Mounting Type: Surface Mount; Operating Temperature - Junction: -55°C ~ 125°C; Package / Case: DO-214AC, SMA; Packaging: TapeAndReel; PartId: 1832; Part Status: Active; Price: 0.15; Series: -; Supplier 1: DigiKey; Supplier Part Number 1: 641-2078-1-ND; Supplier Device Package: DO-214AC (SMA); Voltage - DC Reverse (Vr) (Max): 60 V
D?#4 = LED RED 0805: as D?#1 on sheet MicroController; Supplier 1: Digi-Key; Manufacturer Part Number: LH R974-LP-1; RoHS: Yes; Category: LEDs; Stock 1: 35632; Pricing 1: 1=0,26000, 10=0,13900, 100=0,06480, 500=0,05978, 1000=0,04683, 2000=0,04584 (USD); Mount: Surface Mount; Case/Package: 0805; Number of Pins: 2; Color: Red; Case Code (Imperial): 0805; Case Code (Metric): 2012; Min Operating Temperature: -30°C; Max Operating Temperature: 85°C; Packaging: Tape and Reel; Illumination Color: Red; Package Quantity: 1; Series: CHipLED; Length: 2.1mm; Width: 1.25mm; Depth: 1.35mm; Radiation Hardening: No; RoHS Compliant: Yes; ComponentLink1URL: http://www.jameco.com/Jameco/Products/ProdDS/2085634.pdf?src-supplier=Jameco; ComponentLink1Description: http://www.jameco.com/Jameco/Products/ProdDS/2085634.pdf?src-supplier=Jameco; ComponentLink2URL: http://components.arrow.com/part/dataview/0323_01825492?src-supplier=Arrow+Europe; ComponentLink2Description: http://components.arrow.com/part/dataview/0323_01825492?src-supplier=Arrow+Europe; ComponentLink3URL: https://dammedia.osram.info/media/resource/hires/osram-dam-2493888/LH%20R974.pdf?src-supplier=Digi-Key; ComponentLink3Description: https://dammedia.osram.info/media/resource/hires/osram-dam-2493888/LH%20R974.pdf?src-supplier=Digi-Key; ComponentLink4URL: http://www.mouser.com/ds/2/311/LH%20R974%20-%20CHIPLED%200805-318659.pdf?src-supplier=Mouser; ComponentLink4Description: http://www.mouser.com/ds/2/311/LH%20R974%20-%20CHIPLED%200805-318659.pdf?src-supplier=Mouser; ComponentLink5URL: https://www.verical.com/server-webapp/html/getDatasheet?partID=258950&src-supplier=Verical; ComponentLink5Description: https://www.verical.com/server-webapp/html/getDatasheet?partID=258950&src-supplier=Verical; ComponentLink6URL: http://components.arrow.com/part/dataview/41971690S1077610N9133?src-supplier=Arrow+Electronics; ComponentLink6Description: http://components.arrow.com/part/dataview/41971690S1077610N9133?src-supplier=Arrow+Electronics; ComponentLink7URL: http://components.arrow.com/part/dataview/41971690S6190115N2128?src-supplier=Arrow+Electronics; ComponentLink7Description: http://components.arrow.com/part/dataview/41971690S6190115N2128?src-supplier=Arrow+Electronics; Supplier Part Number 1: 475-1415-1-ND
J?#3-J?#5 J?#7 J?#8 = M20-7820242: CONN RCPT 2POS 0.1 GOLD PCB; Part Number: M20-7820242
J?#6 J?#10 J?#11 = NPPN041BFCN-RC: CONN HDR 4POS 0.079 GOLD PCB; Part Number: NPPN041BFCN-RC
J?#9 = NPPN031BFCN-RC: CONN HDR 3POS 0.079 GOLD PCB; Part Number: NPPN031BFCN-RC
J?#12 J?#13 = NPPN041BFCN-RC: CONN HDR 4POS 0.079 GOLD PCB; Manufacturer: Sullins Connector Solutions; Connector Type: Header; Contact Length - Post: 0.094" (2.40mm); Current Rating (Amps): 2A; Material Flammability Rating: UL94 V-0; Number of Positions: 4; Number of Positions Loaded: All; Pitch - Mating: 0.079" (2.00mm); Style: Board to Board; Part Number: NPPN041BFCN-RC; ComponentLink1Description: Datasheet; ComponentLink1URL: https://drawings-pdf.s3.amazonaws.com/10483.pdf; ComponentLink2Description: DigiKey Link; ComponentLink2URL: https://www.digikey.com/en/products/detail/sullins-connector-solutions/NPPN041BFCN-RC/804806; Contact Finish - Mating: Gold; Contact Finish - Post: Gold; Contact Finish Thickness - Mating: Flash; Contact Type: Female Socket; Fastening Type: Push-Pull; Insulation Color: Black; Insulation Height: 0.173" (4.40mm); LastUpdated: 21.06.2022 14:42:51; Lifecycle Status: Active; Minimum Order: 1; Mounting Type: Through Hole; Number of Rows: 1; Operating Temperature: -40°C ~ 105°C; Packaging: Tube; Part Status: Active; Price: 0.30; Series: -; Supplier 1: DigiKey; Supplier Part Number 1: S5751-04-ND; Termination: Solder
L? = SRR1280-330M: FIXED IND 33UH 3.5A 57 MOHM SMD; Manufacturer: Bourns Inc.; Current - Saturation: 3.3A; DC Resistance (DCR): 57mOhm Max; Frequency - Self Resonant: 9.5MHz; Inductance Frequency - Test: 100 kHz; Material - Core: Ferrite; Q @ Freq: 28 @ 2.52MHz; Shielding: Shielded; Tolerance: ±20%; Type: Drum Core, Wirewound; Part Number: SRR1280-330M; ComponentLink1Description: Datasheet; ComponentLink1URL: https://www.bourns.com/docs/Product-Datasheets/SRR1280.pdf; ComponentLink2Description: DigiKey Link; ComponentLink2URL: https://www.digikey.com/en/products/detail/bourns-inc/SRR1280-330M/1969998; Current Rating (Amps): 3.5 A; Device Package: Nonstandard; Height - Seated (Max): 0.315" (8.00mm); Inductance: 33 µH; LastUpdated: 14.12.2023 21:34:16; Lifecycle Status: Active; Minimum Order: 1; Mounting Type: Surface Mount; Operating Temperature: -40°C ~ 125°C; Package / Case: Nonstandard; Packaging: TapeAndReel; PartId: 25; Part Status: Active; Price: 0.51; Series: SRR1280; Size / Dimension: 0.492" L x 0.492" W (12.50mm x 12.50mm); Supplier 1: DigiKey; Supplier Part Number 1: SRR1280-330MCT-ND; Value: 33 µH
R?#7-R?#9 = ERJ-6GEYJ331V: as R?#3 on sheet MicroController; Part Number: ERJ-6GEYJ331V; ComponentLink1Description: Datasheet; ComponentLink1URL: http://industrial.panasonic.com/www-cgi/jvcr13pz.cgi?E+PZ+3+AOA0001+ERJ6GEYJ331V+7+WW; ComponentLink2Description: DigiKey Link; ComponentLink2URL: https://www.digikey.com/en/products/detail/panasonic-electronic-components/ERJ-6GEYJ331V/89726; Composition: Thick Film; Device Package: 0805 (2012 Metric); Features: Automotive AEC-Q200; Height - Seated (Max): 0.028" (0.70mm); LastUpdated: 6.02.2024 21:02:13; Lifecycle Status: Active; Minimum Order: 1; Number of Terminations: 2; Operating Temperature: -55°C ~ 155°C; Packaging: TapeAndReel; PartId: 30017; Part Status: Active; Price: 0.01; Ratings: AEC-Q200; Series: ERJ-6G; Size / Dimension: 0.079" L x 0.049" W (2.00mm x 1.25mm); Supplier 1: DigiKey; Supplier Part Number 1: P330ACT-ND; Supplier Device Package: 0805
  R?#7: Value: 3.1K; Resistance: 3.1K
  R?#8 R?#9: Value: 1K; Resistance: 1K
U?#3 = AMS1117-3.3: IC-1117 V.REG. 1A 3V3 SOT223 SMD AMS; Manufacturer: UMW(Youtai Semiconductor Co., Ltd.); Designed by: Mustafa oğuz Ateş; Supplier: Digikey; Supplier Part Number: 4518-AMS1117-3.3CT-ND; Manufacturer Part Number: AMS1117-3.3; RoHS: No; Category: Uncategorized; Pricing: 1=0,48, 10=0,388, 25=0,3552, 100=0,2644, 250=0,2396, 500=0,19828, 1000=0,14871 (USD)

## Sheet MotorDriversUnit.SchDoc: Teknofest Project
size 381 x 241 mm; SheetNumber: 4; SheetTotal: 4; Prepared by: Mustafa Oğuz ATEŞ
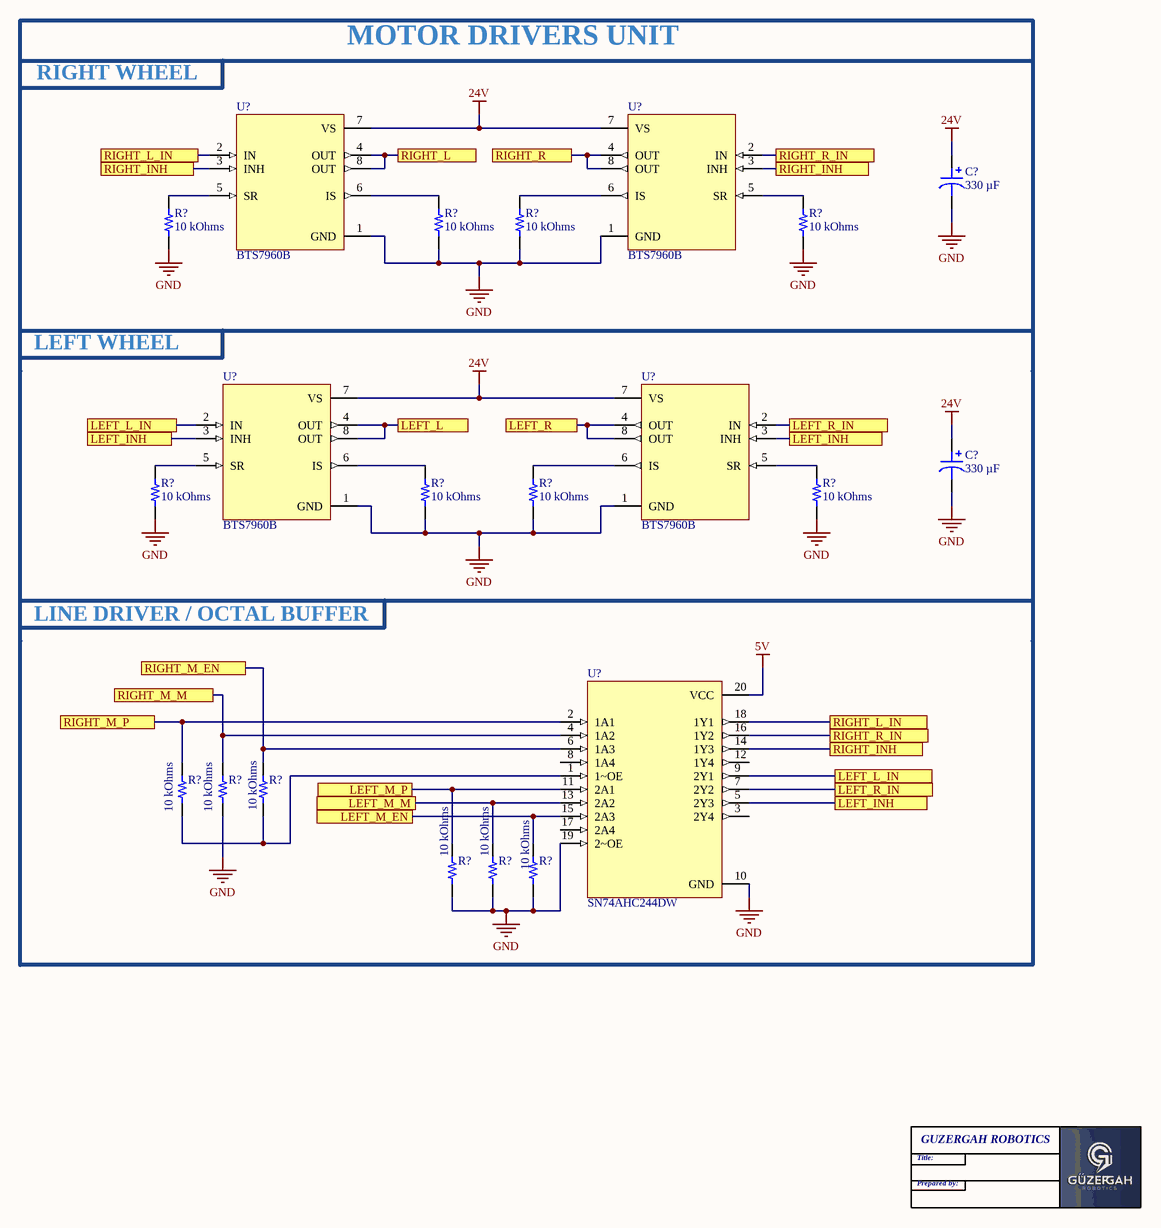
[diagram p3: MotorDriversUnit.SchDoc]

### Parts
(Parts that share a designator on the sheet are numbered #1, #2 ... from top to bottom, then left to right.)
C?#17  330 µF  [CAP ALSMD POLY 8.3MM H10.5MM]
C?#18  330 µF  [CAP ALSMD POLY 8.3MM H10.5MM]
R?#10  10 kOhms  [RES 1206_3216]
R?#11  10 kOhms  [RES 1206_3216]
R?#12  10 kOhms  [RES 1206_3216]
R?#13  10 kOhms  [RES 1206_3216]
R?#14  10 kOhms  [RES 1206_3216]
R?#15  10 kOhms  [RES 1206_3216]
R?#16  10 kOhms  [RES 1206_3216]
R?#17  10 kOhms  [RES 1206_3216]
R?#18  10 kOhms  [RES 1206_3216]
R?#19  10 kOhms  [RES 1206_3216]
R?#20  10 kOhms  [RES 1206_3216]
R?#21  10 kOhms  [RES 1206_3216]
R?#22  10 kOhms  [RES 1206_3216]
R?#23  10 kOhms  [RES 1206_3216]
U?#4  BTS7960B  [DPAK127P1490X440-8N]
U?#5  BTS7960B  [DPAK127P1490X440-8N]
U?#6  BTS7960B  [DPAK127P1490X440-8N]
U?#7  BTS7960B  [DPAK127P1490X440-8N]
U?#8  SN74AHC244DW  [SOIC127P1030X265-20N]

### Ports
LEFT_INH, LEFT_L, LEFT_L_IN, LEFT_M_EN, LEFT_M_M, LEFT_M_P, LEFT_R, LEFT_R_IN, RIGHT_INH, RIGHT_L, RIGHT_L_IN, RIGHT_M_EN, RIGHT_M_M, RIGHT_M_P, RIGHT_R, RIGHT_R_IN

### Nets
5V: U?#8.20(VCC)
24V: C?#17.1 C?#18.1 U?#4.7(VS) U?#5.7(VS) U?#6.7(VS) U?#7.7(VS)
GND: C?#17.2 C?#18.2 R?#10.2 R?#11.2 R?#12.2 R?#13.2 R?#14.2 R?#15.2 R?#16.2 R?#17.2 R?#19.2 R?#21.2 R?#22.2 R?#23.2 U?#4.1(GND) U?#5.1(GND) U?#6.1(GND) U?#7.1(GND) U?#8.10(GND) U?#8.19(2~OE)
NetJ?#7_1: U?#6.4(OUT) U?#6.8(OUT) ; port LEFT_L
NetJ?#7_2: U?#7.4(OUT) U?#7.8(OUT) ; port LEFT_R
NetJ?#8_1: U?#4.4(OUT) U?#4.8(OUT) ; port RIGHT_L
NetJ?#8_2: U?#5.4(OUT) U?#5.8(OUT) ; port RIGHT_R
NetJ?#10_1: R?#23.1 U?#8.15(2A3) ; port LEFT_M_EN
NetJ?#10_2: R?#21.1 U?#8.11(2A1) ; port LEFT_M_P
NetJ?#10_3: R?#22.1 U?#8.13(2A2) ; port LEFT_M_M
NetJ?#11_1: R?#20.1 U?#8.6(1A3) ; port RIGHT_M_EN
NetJ?#11_2: R?#18.1 U?#8.2(1A1) ; port RIGHT_M_P
NetJ?#11_3: R?#19.1 U?#8.4(1A2) ; port RIGHT_M_M
NetR?#10_1: R?#10.1 U?#4.5(SR)
NetR?#11_1: R?#11.1 U?#4.6(IS)
NetR?#12_1: R?#12.1 U?#5.6(IS)
NetR?#13_1: R?#13.1 U?#5.5(SR)
NetR?#14_1: R?#14.1 U?#6.5(SR)
NetR?#15_1: R?#15.1 U?#6.6(IS)
NetR?#16_1: R?#16.1 U?#7.6(IS)
NetR?#17_1: R?#17.1 U?#7.5(SR)
NetR?#18_2: R?#18.2 R?#20.2 U?#8.1(1~OE)
NetU?#4_2: U?#4.2(IN) U?#8.18(1Y1) ; port RIGHT_L_IN
NetU?#4_3: U?#4.3(INH) U?#5.3(INH) U?#8.14(1Y3) ; port RIGHT_INH
NetU?#5_2: U?#5.2(IN) U?#8.16(1Y2) ; port RIGHT_R_IN
NetU?#6_2: U?#6.2(IN) U?#8.9(2Y1) ; port LEFT_L_IN
NetU?#6_3: U?#6.3(INH) U?#7.3(INH) U?#8.5(2Y3) ; port LEFT_INH
NetU?#7_2: U?#7.2(IN) U?#8.7(2Y2) ; port LEFT_R_IN

Not connected (* = marked no-connect by the designer): U?#8 3(2Y4) 8(1A4) 12(1Y4) 17(2A4)

### Notes on the sheet
- MOTOR DRIVERS UNIT
- RIGHT WHEEL
- LEFT WHEEL
- LINE DRIVER / OCTAL BUFFER
- Title:
- Prepared by:
- GUZERGAH ROBOTICS

### Library data of the parts
C?#17 C?#18 = 25PKV330M8X10.5: CAP ALUM HYB 330UF 20% 25V SMD; manufacturer: Rubycon; ESR (Equivalent Series Resistance): 22mOhm; Lifetime @ Temp.: 4000 Hrs @ 125°C; Ripple Current @ High Frequency: 2 A @ 100 kHz; Ripple Current @ Low Frequency: 300 mA @ 100 Hz; Surface Mount Land Size: 0.327" L x 0.327" W (8.30mm x 8.30mm); Type: Hybrid; Part Number: 25PKV330M8X10.5; Applications: Automotive; Capacitance: 330 µF; componentlink1description: Datasheet; componentlink1url: https://www.rubycon.co.jp/wp-content/uploads/catalog-hybrid/PKV.pdf; componentlink2description: DigiKey Link; componentlink2url: https://www.digikey.com/en/products/detail/rubycon/25PKV330M8X10-5/17952146; Height - Seated (Max): 0.413" (10.50mm); lastupdated: 3.06.2024 20:17:02; Lifecycle Status: Active; Minimum Order: 1; Mounting Type: Surface Mount; Operating Temperature: -55°C ~ 125°C; packaging: TapeAndReel; partid: 5755; price: 0.65; Ratings: AEC-Q200; series: PKV; Size / Dimension: 0.315" Dia (8.00mm); Supplier 1: DigiKey; Supplier Part Number 1: 1189-25PKV330M8X10.5CT-ND; Tolerance: ±20%; value: 330 µF; Voltage - Rated: 25 V
R?#10-R?#23 = CR1206AFX-1002EAS: as R?#1 on sheet MicroController; Part Number: CR1206AFX-1002EAS; ComponentLink1Description: Datasheet; ComponentLink1URL: //media.digikey.com/pdf/Data%20Sheets/Bourns%20PDFs/CRyyyyA-AS_Model_DS.pdf; ComponentLink2Description: DigiKey Link; ComponentLink2URL: https://www.digikey.com/en/products/detail/bourns-inc/CR1206AFX-1002EAS/10240135; Composition: Thick Film; Device Package: 1206 (3216 Metric); Features: Anti-Sulfur, Automotive AEC-Q200, Moisture Resistant; Height - Seated (Max): 0.026" (0.65mm); LastUpdated: 25.12.2023 20:50:47; Lifecycle Status: Active; Minimum Order: 1; Number of Terminations: 2; Operating Temperature: -55°C ~ 155°C; Package / Case: 1206 (3216 Metric); Packaging: TapeAndReel; PartId: 26960; Part Status: Active; Price: 0.01; Ratings: AEC-Q200; Resistance: 10 kOhms; Series: CR1206A-AS; Size / Dimension: 0.122" L x 0.061" W (3.10mm x 1.55mm); Supplier 1: DigiKey; Supplier Part Number 1: 118-CR1206AFX-1002EASCT-ND; Supplier Device Package: 1206; Tolerance: ±1%; Value: 10 kOhms
U?#8 = SN74AHC244DW: IC BUFFER INVERT 5.5V 20SOIC

## Nets that join several sheets
3V3: MicroController (18 pins), PowerManagement (5 pins)
5V: MicroController (BZ?.1 C?#9.2), PowerManagement (9 pins), MotorDriversUnit (U?#8.20)
24V: PowerManagement (C?#11.1 J?#3.1 J?#9.1 U?#2.1), MotorDriversUnit (6 pins)
GND: MicroController (24 pins), PowerManagement (20 pins), MotorDriversUnit (20 pins)
NetJ?#7_1: PowerManagement (J?#7.1), MotorDriversUnit (U?#6.4 U?#6.8)
NetJ?#7_2: PowerManagement (J?#7.2), MotorDriversUnit (U?#7.4 U?#7.8)
NetJ?#8_1: PowerManagement (J?#8.1), MotorDriversUnit (U?#4.4 U?#4.8)
NetJ?#8_2: PowerManagement (J?#8.2), MotorDriversUnit (U?#5.4 U?#5.8)
NetJ?#10_1: MicroController (U?#1.17), PowerManagement (J?#10.1), MotorDriversUnit (R?#23.1 U?#8.15)
NetJ?#10_2: MicroController (U?#1.43), PowerManagement (J?#10.2), MotorDriversUnit (R?#21.1 U?#8.11)
NetJ?#10_3: MicroController (U?#1.44), PowerManagement (J?#10.3), MotorDriversUnit (R?#22.1 U?#8.13)
NetJ?#11_1: MicroController (U?#1.20), PowerManagement (J?#11.1), MotorDriversUnit (R?#20.1 U?#8.6)
NetJ?#11_2: MicroController (U?#1.41), PowerManagement (J?#11.2), MotorDriversUnit (R?#18.1 U?#8.2)
NetJ?#11_3: MicroController (U?#1.42), PowerManagement (J?#11.3), MotorDriversUnit (R?#19.1 U?#8.4)
NetJ?#12_2: MicroController (U?#1.55), PowerManagement (J?#12.2)
NetJ?#12_3: MicroController (U?#1.56), PowerManagement (J?#12.3)
NetJ?#13_2: MicroController (U?#1.22), PowerManagement (J?#13.2)
NetJ?#13_3: MicroController (U?#1.23), PowerManagement (J?#13.3)